# EAGLE design M843E (EAGLE 6.6.0)
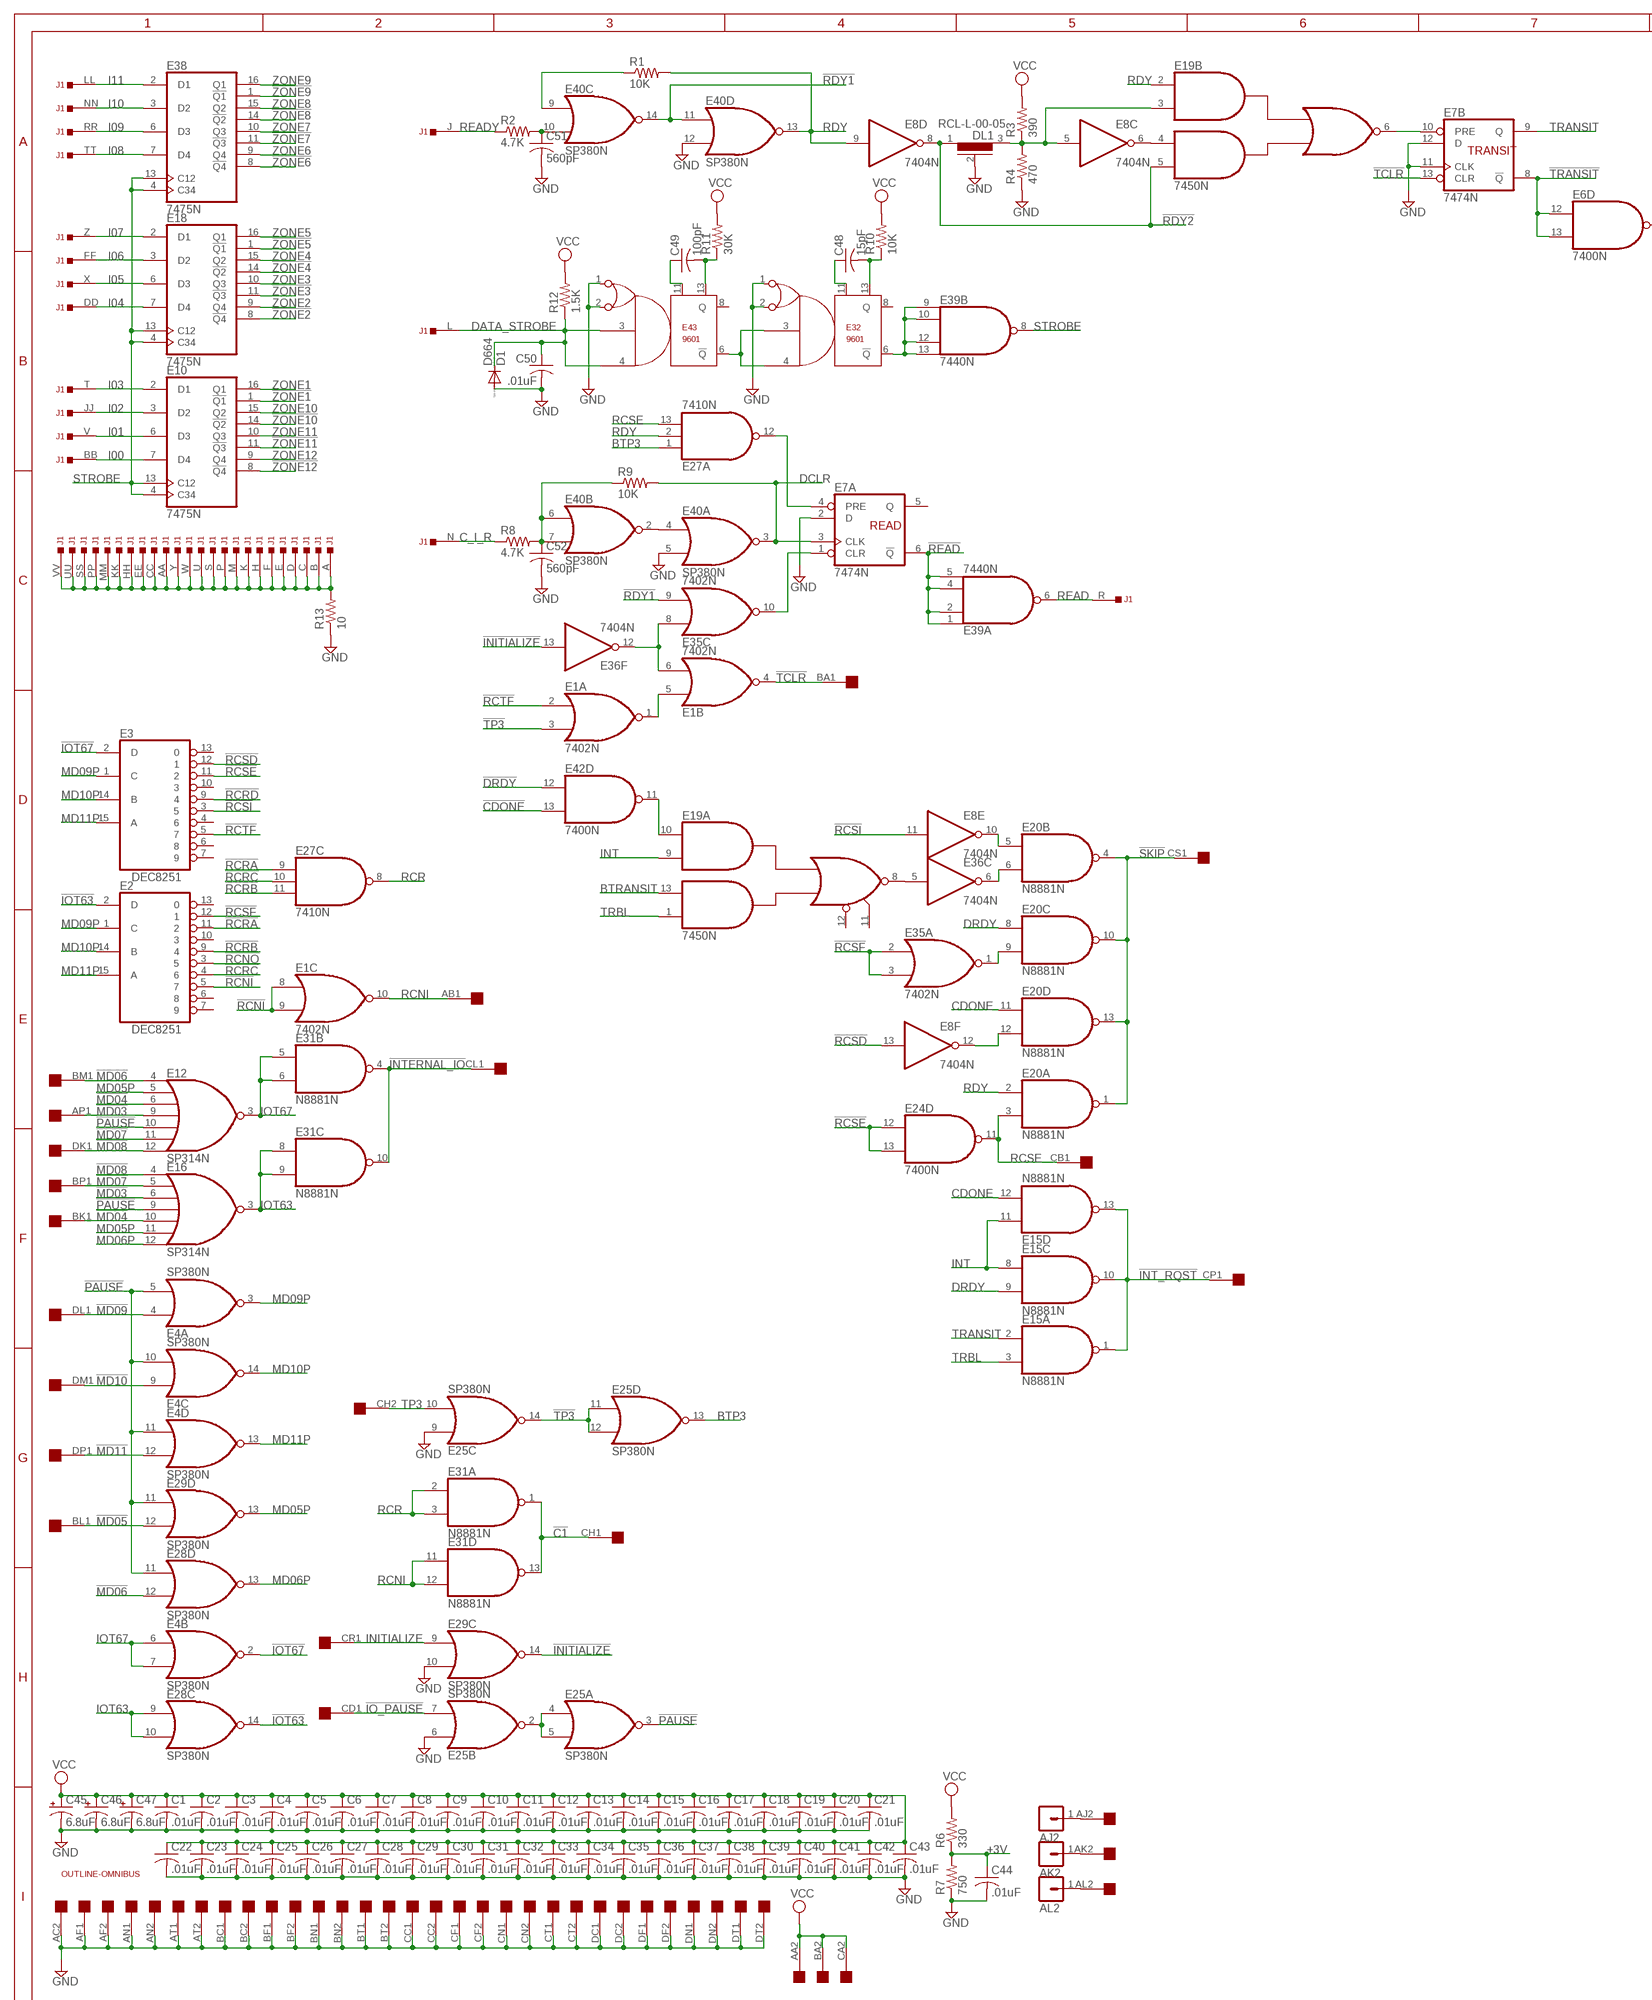
[diagram p0: schematic, sheet 1, part 1 of 2]
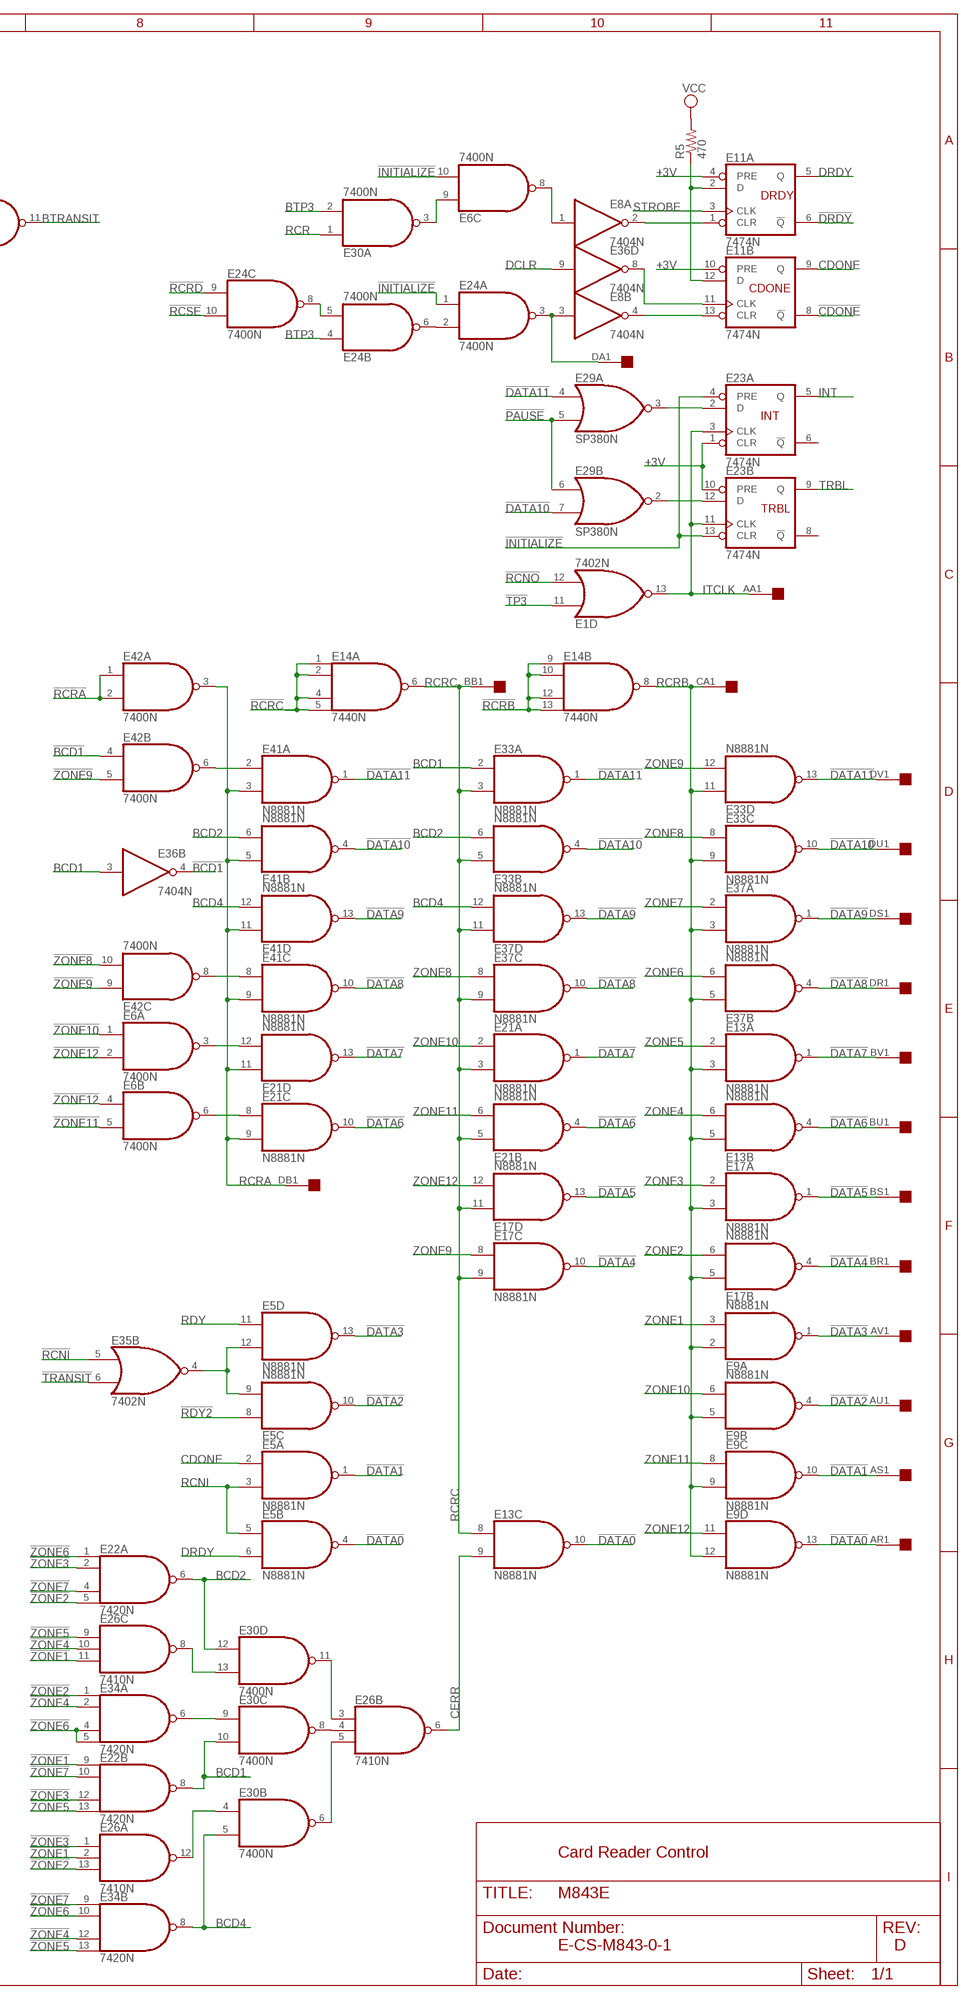
[diagram p1: schematic, sheet 1, part 2 of 2]

## Parts
AJ2  MA01-1  [MA01-1]
AK2  MA01-1  [MA01-1]
AL2  MA01-1  [MA01-1]
C1  .01uF  C-US075-032X103  [C075-032X103]
C2  .01uF  C-US  [C063-025X075]
C3  .01uF  C-US  [C063-025X075]
C4  .01uF  C-US  [C063-025X075]
C5  .01uF  C-US  [C063-025X075]
C6  .01uF  C-US075-032X103  [C075-032X103]
C7  .01uF  C-US  [C063-025X075]
C8  .01uF  C-US  [C063-025X075]
C9  .01uF  C-US  [C063-025X075]
C10  .01uF  C-US  [C063-025X075]
C11  .01uF  C-US  [C063-025X075]
C12  .01uF  C-US  [C063-025X075]
C13  .01uF  C-US  [C063-025X075]
C14  .01uF  C-US  [C063-025X075]
C15  .01uF  C-US  [C063-025X075]
C16  .01uF  C-US  [C063-025X075]
C17  .01uF  C-US  [C063-025X075]
C18  .01uF  C-US  [C063-025X075]
C19  .01uF  C-US  [C063-025X075]
C20  .01uF  C-US  [C063-025X075]
C21  .01uF  C-US  [C063-025X075]
C22  .01uF  C-US  [C063-025X075]
C23  .01uF  C-US  [C063-025X075]
C24  .01uF  C-US  [C063-025X075]
C25  .01uF  C-US  [C063-025X075]
C26  .01uF  C-US  [C063-025X075]
C27  .01uF  C-US  [C063-025X075]
C28  .01uF  C-US  [C063-025X075]
C29  .01uF  C-US  [C063-025X075]
C30  .01uF  C-US  [C063-025X075]
C31  .01uF  C-US  [C063-025X075]
C32  .01uF  C-US  [C063-025X075]
C33  .01uF  C-US  [C063-025X075]
C34  .01uF  C-US  [C063-025X075]
C35  .01uF  C-US  [C063-025X075]
C36  .01uF  C-US  [C063-025X075]
C37  .01uF  C-US  [C063-025X075]
C38  .01uF  C-US  [C063-025X075]
C39  .01uF  C-US  [C063-025X075]
C40  .01uF  C-US  [C063-025X075]
C41  .01uF  C-US  [C063-025X075]
C42  .01uF  C-US  [C063-025X075]
C43  .01uF  C-US  [C063-025X075]
C44  .01uF  C-US  [C063-025X075]
C45  6.8uF  CPOL-USE20-8AXIAL  [E12-8]
C46  6.8uF  CPOL-USE20-8AXIAL  [E12-8]
C47  6.8uF  CPOL-USE20-8AXIAL  [E12-8]
C48  15pF  C-US075-032X103  [C075-032X103]
C49  100pF  C-US075-032X103  [C075-032X103]
C50  .01uF  C-US  [C063-025X075]
C51  560pF  C-US075-032X103  [C075-032X103]
C52  560pF  C-US075-032X103  [C075-032X103]
D1  D664  DIODE-DO35-10  [DO35-10]
DL1  RCL-L-00-05  [RCL-L-00-05]
E1  7402N  [DIL14]
E2  DEC8251  [DIL16]
E3  DEC8251  [DIL16]
E4  SP380N  [DIL14]
E5  N8881N  [DIL14]
E6  7400N  [DIL14]
E7  7474N  74S74N  [DIL14]
E8  7404N  [DIL14]
E9  N8881N  [DIL14]
E10  7475N  [DIL16]
E11  7474N  74S74N  [DIL14]
E12  SP314N  [DIL14]
E13  N8881N  [DIL14]
E14  7440N  [DIL14]
E15  N8881N  [DIL14]
E16  SP314N  [DIL14]
E17  N8881N  [DIL14]
E18  7475N  [DIL16]
E19  7450N  [DIL14]
E20  N8881N  [DIL14]
E21  N8881N  [DIL14]
E22  7420N  [DIL14]
E23  7474N  74S74N  [DIL14]
E24  7400N  [DIL14]
E25  SP380N  [DIL14]
E26  7410N  [DIL14]
E27  7410N  [DIL14]
E28  SP380N  [DIL14]
E29  SP380N  [DIL14]
E30  7400N  [DIL14]
E31  N8881N  [DIL14]
E32  9601  [DIL14]
E33  N8881N  [DIL14]
E34  7420N  [DIL14]
E35  7402N  [DIL14]
E36  7404N  [DIL14]
E37  N8881N  [DIL14]
E38  7475N  [DIL16]
E39  7440N  [DIL14]
E40  SP380N  [DIL14]
E41  N8881N  [DIL14]
E42  7400N  [DIL14]
E43  9601  [DIL14]
EDGE  OMNIBUS  QUAD  [EDGE-CON8]
J1  DEC40PINSH  [DEC40PINH]
R1  10K  R-US_0207/10  [0207/10]
R2  4.7K  R-US_0207/10  [0207/10]
R3  390  R-US_0207/10  [0207/10]
R4  470  R-US_0207/10  [0207/10]
R5  470  R-US_0207/10  [0207/10]
R6  330  R-US_0207/10  [0207/10]
R7  750  R-US_0207/10  [0207/10]
R8  4.7K  R-US_0207/10  [0207/10]
R9  10K  R-US_0207/10  [0207/10]
R10  10K  R-US_0207/10  [0207/10]
R11  30K  R-US_0207/10  [0207/10]
R12  1.5K  R-US_0207/10  [0207/10]
R13  10  R-US_0207/10  [0207/10]
U$4  OUTLINE-OMNIBUS  [OMNIBUS]

## Nets
!BCD1: E36.4(B:O) E42.4(B:I0)
!C1: E31.1(A:O) E31.13(D:O) EDGE.CH1
!CDONE: E11.8(B:!Q) E42.13(D:I1)
!DATA0: E5.4(B:O) E9.13(D:O) E13.10(C:O) EDGE.AR1
!DATA1: E5.1(A:O) E9.10(C:O) EDGE.AS1
!DATA2: E5.10(C:O) E9.4(B:O) EDGE.AU1
!DATA3: E5.13(D:O) E9.1(A:O) EDGE.AV1
!DATA4: E17.4(B:O) E17.10(C:O) EDGE.BR1
!DATA5: E17.1(A:O) E17.13(D:O) EDGE.BS1
!DATA6: E13.4(B:O) E21.4(B:O) E21.10(C:O) EDGE.BU1
!DATA7: E13.1(A:O) E21.1(A:O) E21.13(D:O) EDGE.BV1
!DATA8: E37.4(B:O) E37.10(C:O) E41.10(C:O) EDGE.DR1
!DATA9: E37.1(A:O) E37.13(D:O) E41.13(D:O) EDGE.DS1
!DATA10: E29.7(B:I1) E33.4(B:O) E33.10(C:O) E41.4(B:O) EDGE.DU1
!DATA11: E29.4(A:I0) E33.1(A:O) E33.13(D:O) E41.1(A:O) EDGE.DV1
!DRDY: E11.6(A:!Q) E42.12(D:I0)
!INITIALIZE: E6.10(C:I1) E23.4(A:PRE) E23.13(B:CLR) E24.1(A:I0) E29.14(C:O) E36.13(F:I)
!INT_RQST: E15.1(A:O) E15.10(C:O) E15.13(D:O) EDGE.CP1
!INTERNAL_IO: E31.4(B:O) E31.10(C:O) EDGE.CL1
!IO_PAUSE: E25.7(B:I1) EDGE.CD1
!IOT63: E2.2(D) E28.14(C:O)
!IOT67: E3.2(D) E4.2(B:O)
!MD03: E12.9(I3) E16.6(I2) EDGE.AP1
!MD04: E12.6(I2) E16.10(I4) EDGE.BK1
!MD05: E29.12(D:I1) EDGE.BL1
!MD06: E12.4(I0) E28.12(D:I1) EDGE.BM1
!MD07: E12.11(I5) E16.5(I1) EDGE.BP1
!MD08: E12.12(I6) E16.4(I0) EDGE.DK1
!MD09: E4.4(A:I0) EDGE.DL1
!MD10: E4.9(C:I0) EDGE.DM1
!MD11: E4.12(D:I1) EDGE.DP1
!PAUSE: E4.5(A:I1) E4.10(C:I1) E4.11(D:I0) E12.10(I4) E16.9(I3) E25.3(A:O) E28.11(D:I0) E29.5(A:I1) E29.6(B:I0) E29.11(D:I0)
!RCNI: E1.8(C:I0) E1.9(C:I1) E2.5 E35.5(B:I0)
!RCNO: E1.12(D:I1) E2.3
!RCRA: E2.11 E27.9(C:I0) E42.1(A:I0) E42.2(A:I1)
!RCRB: E2.9 E14.9(B:I0) E14.10(B:I1) E14.12(B:I2) E14.13(B:I3) E27.11(C:I2)
!RCRC: E2.4 E14.1(A:I0) E14.2(A:I1) E14.4(A:I2) E14.5(A:I3) E27.10(C:I1)
!RCRD: E3.9 E24.9(C:I0)
!RCSD: E3.12 E8.13(F:I)
!RCSE: E3.11 E24.10(C:I1) E24.12(D:I0) E24.13(D:I1)
!RCSF: E2.12 E35.2(A:I0) E35.3(A:I1)
!RCSI: E3.3 E8.11(E:I)
!RCTF: E1.2(A:I0) E3.5
!RDY1: E35.9(C:I1) E40.11(D:I0) E40.14(C:O)
!RDY2: DL1.1 E5.8(C:I0) E8.8(D:O) E19.5(B:I4)
!READ: E7.6(A:!Q) E39.1(A:I0) E39.2(A:I1) E39.4(A:I2) E39.5(A:I3)
!SKIP: E20.1(A:O) E20.4(B:O) E20.10(C:O) E20.13(D:O) EDGE.CS1
!TCLR: E1.4(B:O) E7.13(B:CLR) EDGE.BA1
!TP3: E1.3(A:I1) E1.11(D:I0) E25.11(D:I0) E25.12(D:I1) E25.14(C:O)
!TRANSIT: E6.12(D:I0) E6.13(D:I1) E7.8(B:!Q) E35.6(B:I1)
!ZONE1: E10.1(!Q1) E22.9(B:I0) E26.2(A:I1) E26.11(C:I2)
!ZONE2: E18.8(!Q4) E22.5(A:I3) E26.13(A:I2) E34.1(A:I0)
!ZONE3: E18.11(!Q3) E22.2(A:I1) E22.12(B:I2) E26.1(A:I0)
!ZONE4: E18.14(!Q2) E26.10(C:I1) E34.2(A:I1) E34.12(B:I2)
!ZONE5: E18.1(!Q1) E22.13(B:I3) E26.9(C:I0) E34.13(B:I3)
!ZONE6: E22.1(A:I0) E34.4(A:I2) E34.5(A:I3) E34.10(B:I1) E38.8(!Q4)
!ZONE7: E22.4(A:I2) E22.10(B:I1) E34.9(B:I0) E38.11(!Q3)
!ZONE8: E38.14(!Q2) E42.10(C:I1)
!ZONE9: E38.1(!Q1) E42.5(B:I1) E42.9(C:I0)
!ZONE10: E6.1(A:I0) E10.14(!Q2)
!ZONE11: E6.5(B:I1) E10.11(!Q3)
!ZONE12: E6.2(A:I1) E6.4(B:I0) E10.8(!Q4)
+3V: C44.1 E11.4(A:PRE) E11.10(B:PRE) E23.1(A:CLR) E23.10(B:PRE) R6.1 R7.2
AJ2: AJ2.1 EDGE.AJ2
AK2: AK2.1 EDGE.AK2
AL2: AL2.1 EDGE.AL2
BCD1: E22.8(B:O) E30.10(C:I1) E33.2(A:I0) E36.3(B:I)
BCD2: E22.6(A:O) E30.12(D:I0) E33.6(B:I1) E41.6(B:I1)
BCD4: E30.5(B:I1) E34.8(B:O) E37.12(D:I1) E41.12(D:I1)
BTP3: E24.4(B:I0) E25.13(D:O) E27.1(A:I0) E30.2(A:I1)
BTRANSIT: E6.11(D:O) E19.13(A:I3)
C_I_R: J1.N R8.1
CDONE: E5.2(A:I0) E11.9(B:Q) E15.12(D:I1) E20.11(D:I0)
CERR: E13.9(C:I1) E26.6(B:O)
DATA_STROBE: C50.1 D1.C E43.3 E43.4 J1.L R12.1
DCLR: E7.3(A:CLK) E36.9(D:I) E40.3(A:O) R9.2
DRDY: E5.6(B:I1) E11.5(A:Q) E15.9(C:I1) E20.8(C:I0)
GND [Supply]: C1.2 C2.2 C3.2 C4.2 C5.2 C6.2 C7.2 C8.2 C9.2 C10.2 C11.2 C12.2 C13.2 C14.2 C15.2 C16.2 C17.2 C18.2 C19.2 C20.2 C21.2 C22.2 C23.2 C24.2 C25.2 C26.2 C27.2 C28.2 C29.2 C30.2 C31.2 C32.2 C33.2 C34.2 C35.2 C36.2 C37.2 C38.2 C39.2 C40.2 C41.2 C42.2 C43.2 C44.2 C45.- C46.- C47.- C50.2 C51.2 C52.2 D1.A DL1.2 E7.2(A:D) E7.11(B:CLK) E7.12(B:D) E25.6(B:I0) E25.9(C:I0) E29.10(C:I1) E32.1 E32.2 E40.5(A:I1) E40.12(D:I1) E43.1 E43.2 EDGE.AC2 EDGE.AF1 EDGE.AF2 EDGE.AN1 EDGE.AN2 EDGE.AT1 EDGE.AT2 EDGE.BC1 EDGE.BC2 EDGE.BF1 EDGE.BF2 EDGE.BN1 EDGE.BN2 EDGE.BT1 EDGE.BT2 EDGE.CC1 EDGE.CC2 EDGE.CF1 EDGE.CF2 EDGE.CN1 EDGE.CN2 EDGE.CT1 EDGE.CT2 EDGE.DC1 EDGE.DC2 EDGE.DF1 EDGE.DF2 EDGE.DN1 EDGE.DN2 EDGE.DT1 EDGE.DT2 R4.1 R7.1 R13.1
I00: E10.7(D4) J1.BB
I01: E10.6(D3) J1.V
I02: E10.3(D2) J1.JJ
I03: E10.2(D1) J1.T
I04: E18.7(D4) J1.DD
I05: E18.6(D3) J1.X
I06: E18.3(D2) J1.FF
I07: E18.2(D1) J1.Z
I08: E38.7(D4) J1.TT
I09: E38.6(D3) J1.RR
I10: E38.3(D2) J1.NN
I11: E38.2(D1) J1.LL
INITIALIZE: E29.9(C:I0) EDGE.CR1
INT: E15.8(C:I0) E15.11(D:I0) E19.9(A:I2) E23.5(A:Q)
IOT63: E16.3(O) E28.9(C:I0) E28.10(C:I1) E31.8(C:I0) E31.9(C:I1)
IOT67: E4.6(B:I0) E4.7(B:I1) E12.3(O) E31.5(B:I0) E31.6(B:I1)
ITCLK: E1.13(D:O) E23.3(A:CLK) E23.11(B:CLK) EDGE.AA1
MD05P: E12.5(I1) E16.11(I5) E29.13(D:O)
MD06P: E16.12(I6) E28.13(D:O)
MD09P: E2.1(C) E3.1(C) E4.3(A:O)
MD10P: E2.14(B) E3.14(B) E4.14(C:O)
MD11P: E2.15(A) E3.15(A) E4.13(D:O)
N$1: E26.3(B:I0) E30.11(D:O)
N$2: E25.2(B:O) E25.4(A:I0) E25.5(A:I1)
N$3: E11.11(B:CLK) E36.8(D:O)
N$4: E6.8(C:O) E8.1(A:I)
N$5: E5.9(C:I1) E5.12(D:I1) E35.4(B:O)
N$6: E32.6(!Q) E39.9(B:I0) E39.10(B:I1) E39.12(B:I2) E39.13(B:I3)
N$7: E32.3 E32.4 E43.6(!Q)
N$8: E26.4(B:I1) E30.8(C:O)
N$9: C49.2 E43.13 R11.1
N$10: E30.9(C:I0) E34.6(A:O)
N$11: C49.1 E43.11
N$12: C48.2 E32.13 R10.1
N$13: C52.1 E40.6(B:I0) E40.7(B:I1) R8.2 R9.1
N$14: C48.1 E32.11
N$15: E19.8(A:O) E36.5(C:I)
N$16: E40.2(B:O) E40.4(A:I0)
N$18: C51.1 E40.10(C:I1) R2.2
N$19: E26.5(B:I2) E30.6(B:O)
N$20: E6.3(A:O) E21.12(D:I1)
N$21: E41.2(A:I0) E42.6(B:O)
N$22: DL1.3 E8.5(C:I) E19.3(B:I2) R3.1 R4.2
N$23: E6.6(B:O) E21.8(C:I0)
N$24: E41.8(C:I0) E42.8(C:O)
N$25: E40.9(C:I0) R1.1
N$26: E8.6(C:O) E19.4(B:I3)
N$27: E8.4(B:O) E11.13(B:CLR)
N$28: E8.3(B:I) E24.3(A:O) EDGE.DA1
N$29: E6.9(C:I0) E30.3(A:O)
N$30: E8.2(A:O) E11.1(A:CLR)
N$31: E7.10(B:PRE) E19.6(B:O)
N$32: E26.12(A:O) E30.4(B:I0)
N$33: E26.8(C:O) E30.13(D:I1)
N$34: E11.2(A:D) E11.12(B:D) R5.1
N$35: E7.1(A:CLR) E35.10(C:O)
N$36 [Supply]: J1.A J1.AA J1.B J1.C J1.CC J1.D J1.E J1.EE J1.F J1.H J1.HH J1.K J1.KK J1.M J1.MM J1.P J1.PP J1.S J1.SS J1.U J1.UU J1.VV J1.W J1.Y R13.2
N$37: E23.2(A:D) E29.3(A:O)
N$38: E7.4(A:PRE) E27.12(A:O)
N$39: E20.6(B:I1) E36.6(C:O)
N$40: E19.10(A:I1) E42.11(D:O)
N$41: E24.2(A:I1) E24.6(B:O)
N$42: E20.9(C:I1) E35.1(A:O)
N$43: E8.12(F:O) E20.12(D:I1)
N$44: E1.6(B:I1) E35.8(C:I0) E36.12(F:O)
N$45: E23.12(B:D) E29.2(B:O)
N$46: E1.1(A:O) E1.5(B:I0)
N$47: E24.5(B:I1) E24.8(C:O)
RCNI: E1.10(C:O) E5.3(A:I1) E5.5(B:I0) E31.11(D:I0) E31.12(D:I1) EDGE.AB1
RCR: E27.8(C:O) E30.1(A:I0) E31.2(A:I0) E31.3(A:I1)
RCRA: E21.9(C:I1) E21.11(D:I0) E41.3(A:I1) E41.5(B:I0) E41.9(C:I1) E41.11(D:I0) E42.3(A:O) EDGE.DB1
RCRB: E9.2(A:I0) E9.5(B:I0) E9.9(C:I1) E9.12(D:I1) E13.3(A:I1) E13.5(B:I0) E14.8(B:O) E17.3(A:I1) E17.5(B:I0) E33.9(C:I1) E33.11(D:I0) E37.3(A:I1) E37.5(B:I0) EDGE.CA1
RCRC: E13.8(C:I0) E14.6(A:O) E17.9(C:I1) E17.11(D:I0) E21.3(A:I1) E21.5(B:I0) E33.3(A:I1) E33.5(B:I0) E37.9(C:I1) E37.11(D:I0) EDGE.BB1
RCSE: E20.3(A:I1) E24.11(D:O) E27.13(A:I2) EDGE.CB1
RCSI: E8.10(E:O) E20.5(B:I0)
RDY: E5.11(D:I0) E8.9(D:I) E19.2(B:I1) E20.2(A:I0) E27.2(A:I1) E40.13(D:O) R1.2
READ: E39.6(A:O) J1.R
READY: J1.J R2.1
STROBE: E10.4(C34) E10.13(C12) E11.3(A:CLK) E18.4(C34) E18.13(C12) E38.4(C34) E38.13(C12) E39.8(B:O)
TP3: E25.10(C:I1) EDGE.CH2
TRANSIT: E7.9(B:Q) E15.2(A:I0)
TRBL: E15.3(A:I1) E19.1(A:I4) E23.9(B:Q)
VCC [Supply]: C1.1 C2.1 C3.1 C4.1 C5.1 C6.1 C7.1 C8.1 C9.1 C10.1 C11.1 C12.1 C13.1 C14.1 C15.1 C16.1 C17.1 C18.1 C19.1 C20.1 C21.1 C22.1 C23.1 C24.1 C25.1 C26.1 C27.1 C28.1 C29.1 C30.1 C31.1 C32.1 C33.1 C34.1 C35.1 C36.1 C37.1 C38.1 C39.1 C40.1 C41.1 C42.1 C43.1 C45.+ C46.+ C47.+ EDGE.AA2 EDGE.BA2 EDGE.CA2 R3.2 R5.2 R6.2 R10.2 R11.2 R12.2
ZONE1: E9.3(A:I1) E10.16(Q1)
ZONE2: E17.6(B:I1) E18.9(Q4)
ZONE3: E17.2(A:I0) E18.10(Q3)
ZONE4: E13.6(B:I1) E18.15(Q2)
ZONE5: E13.2(A:I0) E18.16(Q1)
ZONE6: E37.6(B:I1) E38.9(Q4)
ZONE7: E37.2(A:I0) E38.10(Q3)
ZONE8: E33.8(C:I0) E37.8(C:I0) E38.15(Q2)
ZONE9: E17.8(C:I0) E33.12(D:I1) E38.16(Q1)
ZONE10: E9.6(B:I1) E10.15(Q2) E21.2(A:I0)
ZONE11: E9.8(C:I0) E10.10(Q3) E21.6(B:I1)
ZONE12: E9.11(D:I0) E10.9(Q4) E17.12(D:I1)
Unconnected: E2.6 E2.7 E2.10 E2.13 E3.4 E3.6 E3.7 E3.10 E3.13 E7.5(A:Q) E12.2(NC) E12.7(NC) E12.13(NC) E12.14(NC) E13.11(D:I0) E13.12(D:I1) E13.13(D:O) E14.3(3:NC) E14.11(11:NC) E15.4(B:O) E15.5(B:I0) E15.6(B:I1) E16.2(NC) E16.7(NC) E16.13(NC) E16.14(NC) E19.11(A:I6) E19.12(A:I5) E22.3(3:NC) E22.11(11:NC) E23.6(A:!Q) E23.8(B:!Q) E27.3(B:I0) E27.4(B:I1) E27.5(B:I2) E27.6(B:O) E28.2(B:O) E28.3(A:O) E28.4(A:I0) E28.5(A:I1) E28.6(B:I0) E28.7(B:I1) E32.8(Q) E34.3(3:NC) E34.11(11:NC) E35.11(D:I0) E35.12(D:I1) E35.13(D:O) E36.1(A:I) E36.2(A:O) E36.10(E:O) E36.11(E:I) E39.3(3:NC) E39.11(11:NC) E43.8(Q) EDGE.AB2 EDGE.AC1 EDGE.AD1 EDGE.AD2 EDGE.AE1 EDGE.AE2 EDGE.AH1 EDGE.AH2 EDGE.AJ1 EDGE.AK1 EDGE.AL1 EDGE.AM1 EDGE.AM2 EDGE.AP2 EDGE.AR2 EDGE.AS2 EDGE.AU2 EDGE.AV2 EDGE.BB2 EDGE.BD1 EDGE.BD2 EDGE.BE1 EDGE.BE2 EDGE.BH1 EDGE.BH2 EDGE.BJ1 EDGE.BJ2 EDGE.BK2 EDGE.BL2 EDGE.BM2 EDGE.BP2 EDGE.BR2 EDGE.BS2 EDGE.BU2 EDGE.BV2 EDGE.CB2 EDGE.CD2 EDGE.CE1 EDGE.CE2 EDGE.CJ1 EDGE.CJ2 EDGE.CK1 EDGE.CK2 EDGE.CL2 EDGE.CM1 EDGE.CM2 EDGE.CP2 EDGE.CR2 EDGE.CS2 EDGE.CU1 EDGE.CU2 EDGE.CV1 EDGE.CV2 EDGE.DA2 EDGE.DB2 EDGE.DD1 EDGE.DD2 EDGE.DE1 EDGE.DE2 EDGE.DH1 EDGE.DH2 EDGE.DJ1 EDGE.DJ2 EDGE.DK2 EDGE.DL2 EDGE.DM2 EDGE.DP2 EDGE.DR2 EDGE.DS2 EDGE.DU2 EDGE.DV2

## Notes on the sheet
- TRANSIT
- DRDY
- CDONE
- INT
- TRBL
- READ
- Card Reader Control
- E-CS-M843-0-1 | D

## Power pins joined to a net without a drawn wire
GND: E1.7(P:GND) E2.8(GND) E3.8(GND) E4.1(P:GND) E5.7(P:GND) E6.7(P:GND) E7.7(P:GND) E8.7(P:GND) E9.7(P:GND) E10.12(GND) E11.7(P:GND) E12.1(GND) E13.7(P:GND) E14.7(P:GND) E15.7(P:GND) E16.1(GND) E17.7(P:GND) E18.12(GND) E19.7(P:GND) E20.7(P:GND) E21.7(P:GND) E22.7(P:GND) E23.7(P:GND) E24.7(P:GND) E25.1(P:GND) E26.7(P:GND) E27.7(P:GND) E28.1(P:GND) E29.1(P:GND) E30.7(P:GND) E31.7(P:GND) E32.7(GND) E33.7(P:GND) E34.7(P:GND) E35.7(P:GND) E36.7(P:GND) E37.7(P:GND) E38.12(GND) E39.7(P:GND) E40.1(P:GND) E41.7(P:GND) E42.7(P:GND) E43.7(GND)
VCC: E1.14(P:VCC) E2.16(VCC) E3.16(VCC) E4.8(P:VCC) E5.14(P:VCC) E6.14(P:VCC) E7.14(P:VCC) E8.14(P:VCC) E9.14(P:VCC) E10.5(VCC) E11.14(P:VCC) E12.8(VCC) E13.14(P:VCC) E14.14(P:VCC) E15.14(P:VCC) E16.8(VCC) E17.14(P:VCC) E18.5(VCC) E19.14(P:VCC) E20.14(P:VCC) E21.14(P:VCC) E22.14(P:VCC) E23.14(P:VCC) E24.14(P:VCC) E25.8(P:VCC) E26.14(P:VCC) E27.14(P:VCC) E28.8(P:VCC) E29.8(P:VCC) E30.14(P:VCC) E31.14(P:VCC) E32.14(VCC) E33.14(P:VCC) E34.14(P:VCC) E35.14(P:VCC) E36.14(P:VCC) E37.14(P:VCC) E38.5(VCC) E39.14(P:VCC) E40.8(P:VCC) E41.14(P:VCC) E42.14(P:VCC) E43.14(VCC)

## Library data of the parts
AJ2 AK2 AL2 = dec-con:MA01-1: Pin Header (.125" spacing)
C1 C6 C48 C49 C51 C52 = rcl:C-US: CAPACITOR, American symbol
C2-C5 C7-C44 C50 = dec-con:C-US: Capacitors with funky DEC lead spacing.
C45-C47 = dec-con:CPOL-USE20-8AXIAL: A 0.8 inch electrolytic.
D1 = diode:DIODE-: DIODE
DL1 = dec-con:RCL-L-00-05: RCL-L Delay Line
E1 E35 = 74xx-us:74*02: Quad 2-input NOR gate
E2 E3 = dec-con:DEC8251: BCD Decoder
E4 E25 E28 E29 E40 = dec-con:SP380: Quad NOR gate (use 8640)
E5 E9 E13 E15 E17 E20 E21 E31 E33 E37 E41 = dec-con:N8881: Quad 2-input NAND gate, open collector
E6 E24 E30 E42 = 74xx-us:74*00: Quad 2-input NAND gate
E7 E11 E23 = 74xx-us:74*74: Dual D type positive edge triggered FLIP FLOP, preset and clear
E8 E36 = 74xx-us:74*04: Hex INVERTER
E10 E18 E38 = 74xx-us:74*75: 4-bit bistable LATCH
E12 E16 = dec-con:SP314: 7-Input NOR gate
E14 E39 = dec-con:74*40: Dual 4-input NAND gate
E19 = dec-con:74*50: 4-2-3-2 input AND OR INVERTER gates
E22 E34 = dec-con:74*20: Dual 4-input NAND gate
E26 E27 = 74xx-us:74*10: Triple 3-input NAND gate
E32 E43 = dec-con:9601: DEC9601 monstable
EDGE = dec-con:QUAD: Quad-Height DEC board
J1 = dec-con:DEC40PINS: 40 pin ribbon connector for BC08, BC11 cables.
R1-R13 = rcl:R-US_: RESISTOR, American symbol
U$4 = dec-con:OUTLINE-*: Board outlines for DEC boards.

## Net classes
1 Supply: width 0.813 mm

## Board
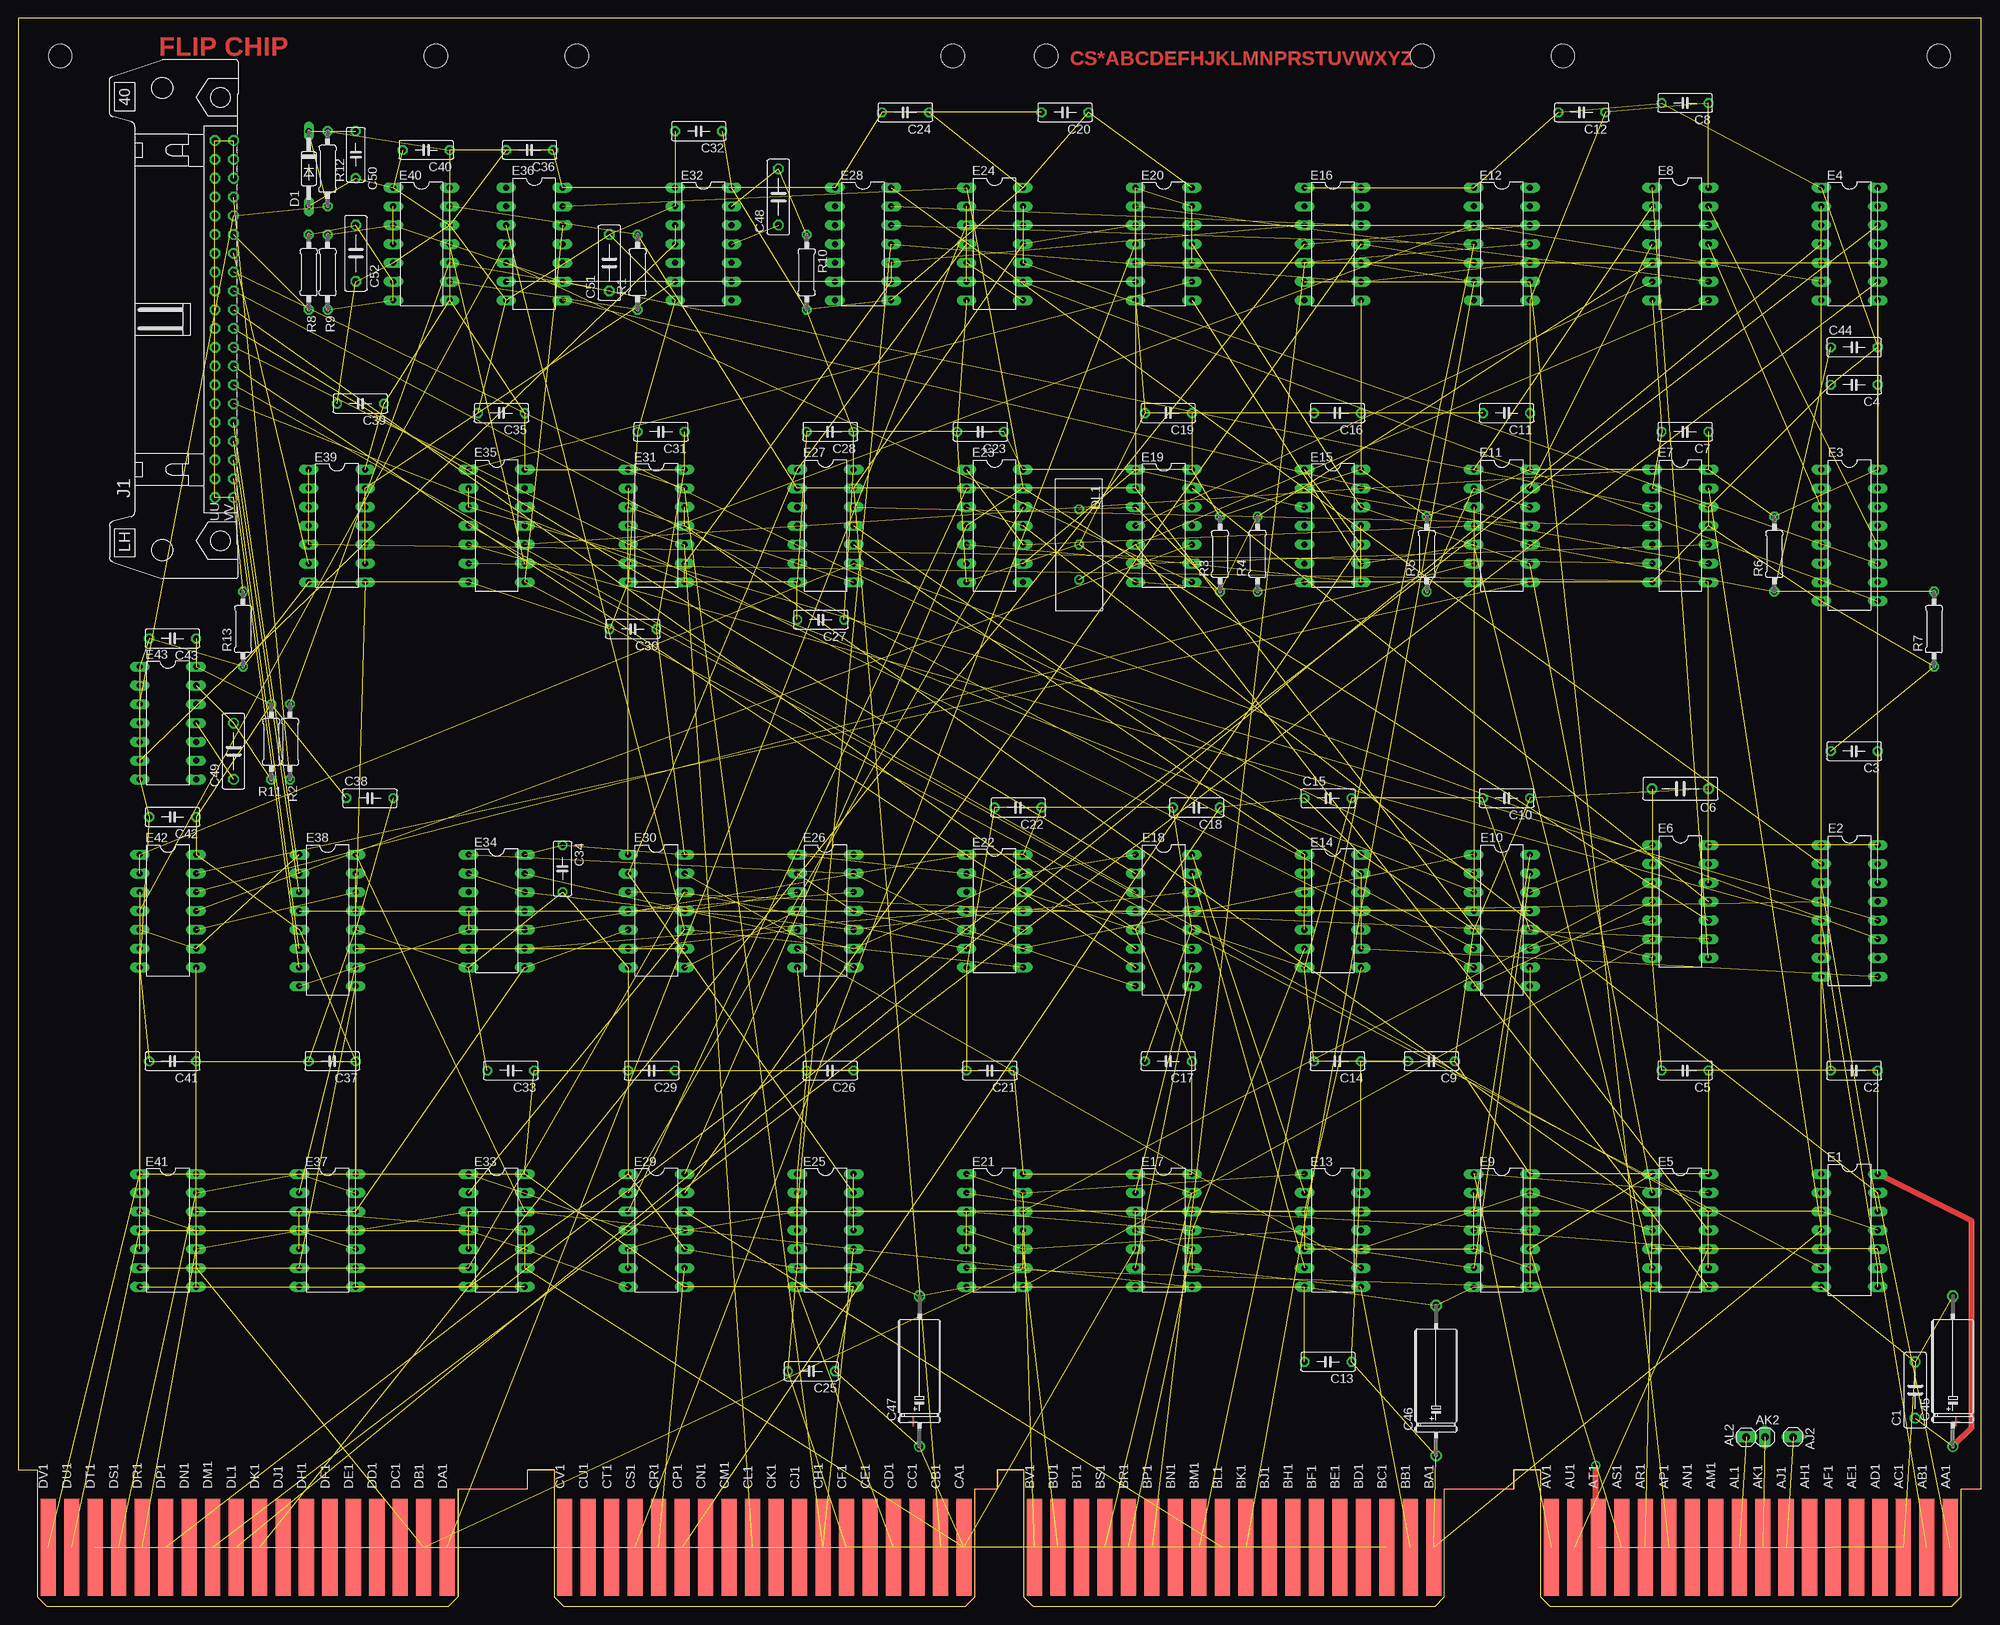
[diagram p2: board, top side]
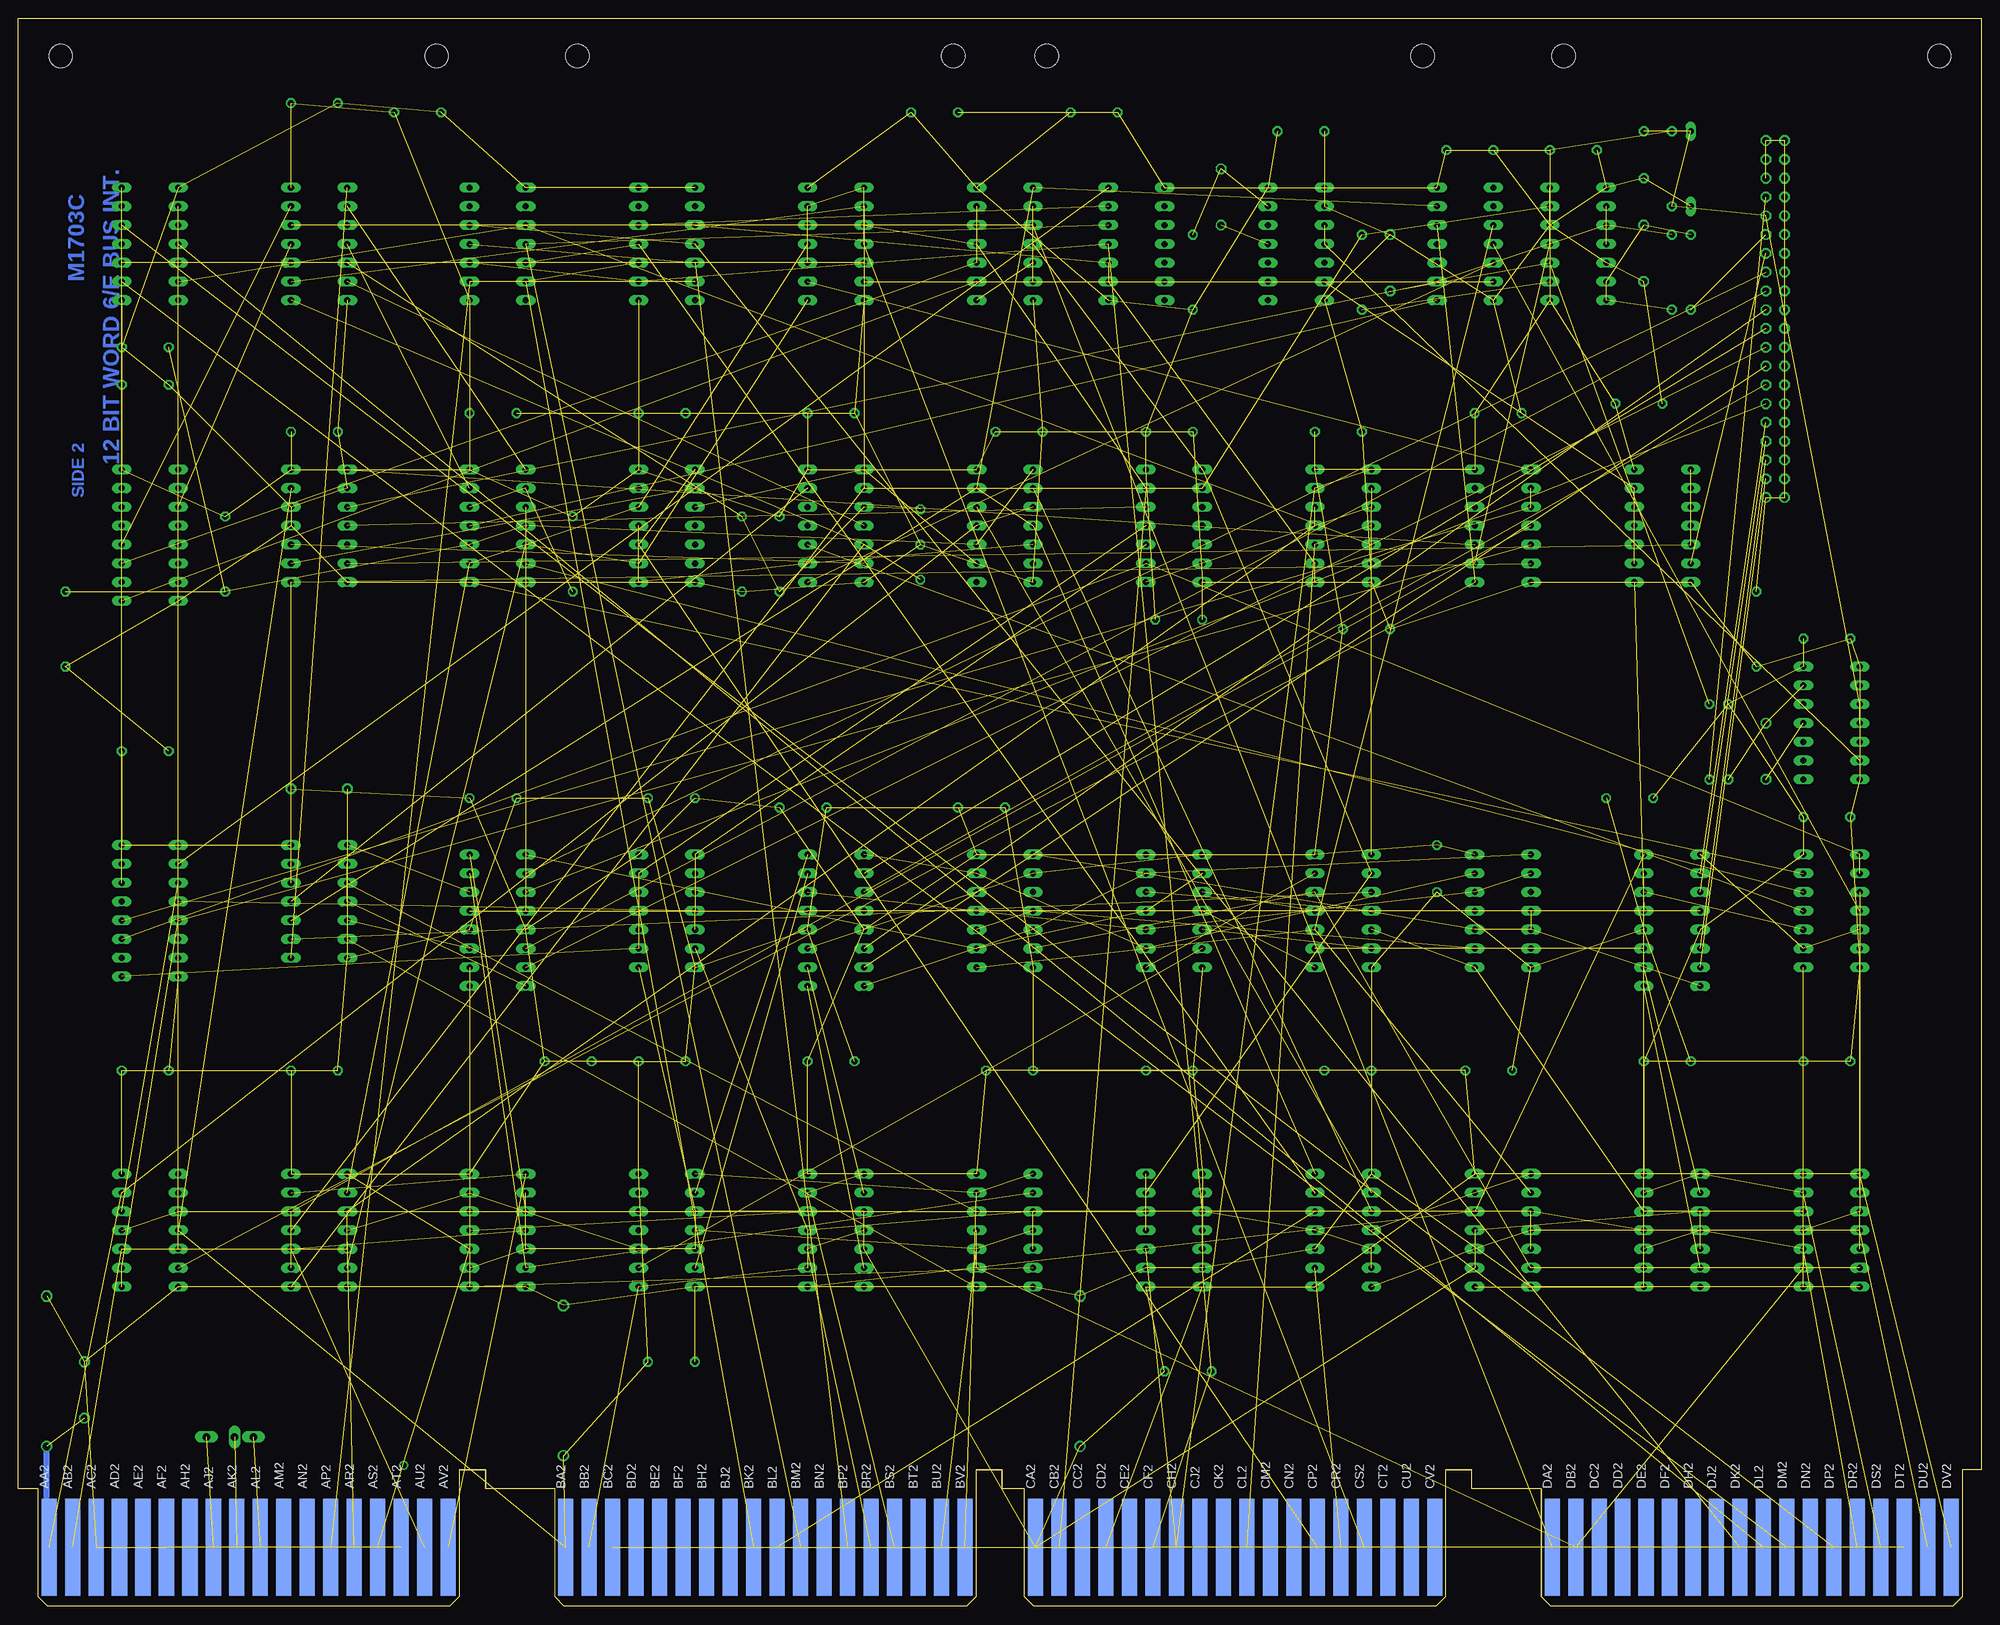
[diagram p3: board, bottom side, seen from below]

Size 265.3 x 214.63 mm. Coordinates in mm from the lower left corner, seen from the top.
Copper layers (1+16): Top 0.035mm / dielectric 1.5mm / Bottom 0.035mm
Design rules "16mils": minimum track width 16mil, minimum drill 32mil, track to track 15mil, track to pad 10mil, pad to pad 10mil, via to via 10mil, smd to smd 10mil, copper to edge 13mil, drill to drill 10mil, minimum pad ring 10mil, minimum via ring 8mil, stop-mask expansion 0mil, vias tented up to drill 0mil, thermal gap 10mil

### Footprints (pad centres in the part's own frame; a part is rotated, then mirrored left to right if it is on the bottom)
MA01-1 = drill 1.016 long: 1 0,0
C075-032X103 = drill 0.914 octagon: 1 -3.81,0; 2 3.81,0
C063-025X075 = drill 0.813 octagon: 1 -2.54,0; 2 3.81,0
E12-8 = drill 1.016: + -10.16,0 | drill 1.016 octagon: - 10.16,0
DO35-10 = drill 0.813 long: A 5.08,0; C -5.08,0
RCL-L-00-05 = drill 0.813 octagon: 1 4.763,0; 2 0,0; 3 -4.763,0
DIL14 = drill 0.813 long: 1 -7.62,-3.81; 2 -5.08,-3.81; 3 -2.54,-3.81; 4 0,-3.81; 5 2.54,-3.81; 6 5.08,-3.81; 7 7.62,-3.81; 8 7.62,3.81; 9 5.08,3.81; 10 2.54,3.81; 11 0,3.81; 12 -2.54,3.81; 13 -5.08,3.81; 14 -7.62,3.81
DIL16 = drill 0.813 long: 1 -8.89,-3.81; 2 -6.35,-3.81; 3 -3.81,-3.81; 4 -1.27,-3.81; 5 1.27,-3.81; 6 3.81,-3.81; 7 6.35,-3.81; 8 8.89,-3.81; 9 8.89,3.81; 10 6.35,3.81; 11 3.81,3.81; 12 1.27,3.81; 13 -1.27,3.81; 14 -3.81,3.81; 15 -6.35,3.81; 16 -8.89,3.81
EDGE-CON8 = smd 2.032 x 13.106: AA1 261.303,7.938; AB1 258.127,7.938; AC1 254.952,7.938; AD1 251.778,7.938; AE1 248.602,7.938; AF1 245.428,7.938; AH1 242.252,7.938; AJ1 239.077,7.938; AK1 235.903,7.938; AL1 232.727,7.938; AM1 229.553,7.938; AN1 226.377,7.938; AP1 223.202,7.938; AR1 220.028,7.938; AS1 216.852,7.938; AT1 213.678,7.938; AU1 210.502,7.938; AV1 207.327,7.938; BA1 191.452,7.938; BB1 188.278,7.938; BC1 185.102,7.938; BD1 181.928,7.938; BE1 178.752,7.938; BF1 175.577,7.938; BH1 172.403,7.938; BJ1 169.227,7.938; BK1 166.053,7.938; BL1 162.877,7.938; BM1 159.702,7.938; BN1 156.528,7.938; BP1 153.352,7.938; BR1 150.178,7.938; BS1 147.002,7.938; BT1 143.827,7.938; BU1 140.653,7.938; BV1 137.477,7.938; CA1 127.953,7.938; CB1 124.778,7.938; CC1 121.603,7.938; CD1 118.427,7.938; CE1 115.252,7.938; CF1 112.078,7.938; CH1 108.903,7.938; CJ1 105.728,7.938; CK1 102.552,7.938; CL1 99.377,7.938; CM1 96.203,7.938; CN1 93.028,7.938; CP1 89.853,7.938; CR1 86.677,7.938; CS1 83.502,7.938; CT1 80.328,7.938; CU1 77.153,7.938; CV1 73.978,7.938; DA1 58.102,7.938; DB1 54.928,7.938; DC1 51.752,7.938; DD1 48.578,7.938; DE1 45.403,7.938; DF1 42.227,7.938; DH1 39.053,7.938; DJ1 35.877,7.938; DK1 32.703,7.938; DL1 29.527,7.938; DM1 26.352,7.938; DN1 23.177,7.938; DP1 20.003,7.938; DR1 16.828,7.938; DS1 13.652,7.938; DT1 10.477,7.938; DU1 7.303,7.938; DV1 4.128,7.938 | smd 2.032 x 13.106 bottom: AA2 261.303,7.938; AB2 258.127,7.938; AC2 254.952,7.938; AD2 251.778,7.938; AE2 248.602,7.938; AF2 245.428,7.938; AH2 242.252,7.938; AJ2 239.077,7.938; AK2 235.903,7.938; AL2 232.727,7.938; AM2 229.553,7.938; AN2 226.377,7.938; AP2 223.202,7.938; AR2 220.028,7.938; AS2 216.852,7.938; AT2 213.678,7.938; AU2 210.502,7.938; AV2 207.327,7.938; BA2 191.452,7.938; BB2 188.278,7.938; BC2 185.102,7.938; BD2 181.928,7.938; BE2 178.752,7.938; BF2 175.577,7.938; BH2 172.403,7.938; BJ2 169.227,7.938; BK2 166.053,7.938; BL2 162.877,7.938; BM2 159.702,7.938; BN2 156.528,7.938; BP2 153.352,7.938; BR2 150.178,7.938; BS2 147.002,7.938; BT2 143.827,7.938; BU2 140.653,7.938; BV2 137.477,7.938; CA2 127.953,7.938; CB2 124.778,7.938; CC2 121.603,7.938; CD2 118.427,7.938; CE2 115.252,7.938; CF2 112.078,7.938; CH2 108.903,7.938; CJ2 105.728,7.938; CK2 102.552,7.938; CL2 99.377,7.938; CM2 96.203,7.938; CN2 93.028,7.938; CP2 89.853,7.938; CR2 86.677,7.938; CS2 83.502,7.938; CT2 80.328,7.938; CU2 77.153,7.938; CV2 73.978,7.938; DA2 58.102,7.938; DB2 54.928,7.938; DC2 51.752,7.938; DD2 48.578,7.938; DE2 45.403,7.938; DF2 42.227,7.938; DH2 39.053,7.938; DJ2 35.877,7.938; DK2 32.703,7.938; DL2 29.527,7.938; DM2 26.352,7.938; DN2 23.177,7.938; DP2 20.003,7.938; DR2 16.828,7.938; DS2 13.652,7.938; DT2 10.477,7.938; DU2 7.303,7.938; DV2 4.128,7.938
DEC40PINH = drill 0.914 octagon: A 24.13,1.27; AA -3.81,1.27; B 24.13,-1.27; BB -3.81,-1.27; C 21.59,1.27; CC -6.35,1.27; D 21.59,-1.27; DD -6.35,-1.27; E 19.05,1.27; EE -8.89,1.27; F 19.05,-1.27; FF -8.89,-1.27; H 16.51,1.27; HH -11.43,1.27; J 16.51,-1.27; JJ -11.43,-1.27; K 13.97,1.27; KK -13.97,1.27; L 13.97,-1.27; LL -13.97,-1.27; M 11.43,1.27; MM -16.51,1.27; N 11.43,-1.27; NN -16.51,-1.27; P 8.89,1.27; PP -19.05,1.27; R 8.89,-1.27; RR -19.05,-1.27; S 6.35,1.27; SS -21.59,1.27; T 6.35,-1.27; TT -21.59,-1.27; U 3.81,1.27; UU -24.13,1.27; V 3.81,-1.27; W 1.27,1.27; X 1.27,-1.27; Y -1.27,1.27; Z -1.27,-1.27 | drill 0.914: VV -24.13,-1.27
0207/10 = drill 0.813 octagon: 1 -5.08,0; 2 5.08,0
OMNIBUS = hole 3.175: 208.915,209.55; 259.715,209.55; 189.865,209.55; 139.065,209.55; 75.616,209.55; 126.416,209.55; 56.566,209.55; 5.766,209.55

### Placement (x,y rotation side)
AJ2  239.9,22.86 270 top
AK2  236.09,22.86 0 top
AL2  233.55,22.86 90 top
C1  256.41,29.21 90 top
C2  248.79,72.39 180 top
C3  248.79,115.57 180 top
C4  248.79,165.1 180 top
C5  225.93,72.39 180 top
C6  224.66,110.49 180 top
C7  225.93,158.75 180 top
C8  225.93,203.2 180 top
C9  191.64,73.66 180 top
C10  201.8,109.22 180 top
C11  201.8,161.29 180 top
C12  211.96,201.93 180 top
C13  177.67,33.02 180 top
C14  178.94,73.66 180 top
C15  176.4,109.22 0 top
C16  178.94,161.29 180 top
C17  156.08,73.66 180 top
C18  159.89,107.95 180 top
C19  156.08,161.29 180 top
C20  142.11,201.93 180 top
C21  131.95,72.39 180 top
C22  135.76,107.95 180 top
C23  130.68,158.75 180 top
C24  120.52,201.93 180 top
C25  107.82,31.75 180 top
C26  110.36,72.39 180 top
C27  109.09,133.35 180 top
C28  110.36,158.75 180 top
C29  86.23,72.39 180 top
C30  83.69,132.08 180 top
C31  87.5,158.75 180 top
C32  92.58,199.39 180 top
C33  67.18,72.39 180 top
C34  73.53,100.33 270 top
C35  65.91,161.29 180 top
C36  69.72,196.85 180 top
C37  43.05,73.66 180 top
C38  46.86,109.22 0 top
C39  46.86,162.56 180 top
C40  55.75,196.85 180 top
C41  21.46,73.66 180 top
C42  21.46,106.68 180 top
C43  21.46,130.81 180 top
C44  247.52,170.18 0 top
C45  261.49,31.75 90 top
C46  191.64,30.48 90 top
C47  121.79,31.75 90 top
C48  102.74,190.5 90 top
C49  29.08,115.57 90 top
C50  45.59,196.85 270 top
C51  79.88,181.61 90 top
C52  45.59,182.88 270 top
D1  39.24,194.31 270 top
DL1  143.38,143.51 270 top
E1  247.52,50.8 270 top
E2  247.52,93.98 270 top
E3  247.52,144.78 270 top
E4  247.52,184.15 270 top
E5  224.66,50.8 270 top
E6  224.66,95.25 270 top
E7  224.66,146.05 270 top
E8  224.66,184.15 270 top
E9  200.53,50.8 270 top
E10  200.53,92.71 270 top
E11  200.53,146.05 270 top
E12  200.53,184.15 270 top
E13  177.67,50.8 270 top
E14  177.67,93.98 270 top
E15  177.67,146.05 270 top
E16  177.67,184.15 270 top
E17  154.81,50.8 270 top
E18  154.81,92.71 270 top
E19  154.81,146.05 270 top
E20  154.81,184.15 270 top
E21  131.95,50.8 270 top
E22  131.95,93.98 270 top
E23  131.95,146.05 270 top
E24  131.95,184.15 270 top
E25  109.09,50.8 270 top
E26  109.09,93.98 270 top
E27  109.09,146.05 270 top
E28  114.17,184.15 270 top
E29  86.23,50.8 270 top
E30  86.23,93.98 270 top
E31  86.23,146.05 270 top
E32  92.58,184.15 270 top
E33  64.64,50.8 270 top
E34  64.64,93.98 270 top
E35  64.64,146.05 270 top
E36  69.72,184.15 270 top
E37  41.78,50.8 270 top
E38  41.78,92.71 270 top
E39  43.05,146.05 270 top
E40  54.48,184.15 270 top
E41  20.19,50.8 270 top
E42  20.19,93.98 270 top
E43  20.19,119.38 270 top
EDGE  -0.13,0 0 top
J1  27.81,173.99 90 top
R1  83.69,180.34 90 top
R2  36.7,116.84 90 top
R3  162.43,142.24 90 top
R4  167.51,142.24 90 top
R5  190.37,142.24 90 top
R6  237.36,142.24 90 top
R7  258.95,132.08 90 top
R8  39.24,180.34 90 top
R9  41.78,180.34 90 top
R10  106.55,180.34 270 top
R11  34.16,116.84 90 top
R12  41.78,194.31 90 top
R13  30.35,132.08 90 top
U$3  [FLIPCHIP]  -0.13,214.63 270 top
U$4  -0.13,0 0 top

### Tracks (layer width: path | path; a pad name or v marks a point on that pad's centre or on a via)
!BCD1  (1 unrouted)
!C1  (2 unrouted)
!CDONE  (1 unrouted)
!DATA0  (3 unrouted)
!DATA1  (2 unrouted)
!DATA2  (2 unrouted)
!DATA3  (2 unrouted)
!DATA4  (2 unrouted)
!DATA5  (2 unrouted)
!DATA6  (3 unrouted)
!DATA7  (3 unrouted)
!DATA8  (3 unrouted)
!DATA9  (3 unrouted)
!DATA10  (4 unrouted)
!DATA11  (4 unrouted)
!DRDY  (1 unrouted)
!INITIALIZE  (5 unrouted)
!INT_RQST  (3 unrouted)
!INTERNAL_IO  (2 unrouted)
!IO_PAUSE  (1 unrouted)
!IOT63  (1 unrouted)
!IOT67  (1 unrouted)
!MD03  (2 unrouted)
!MD04  (2 unrouted)
!MD05  (1 unrouted)
!MD06  (2 unrouted)
!MD07  (2 unrouted)
!MD08  (2 unrouted)
!MD09  (1 unrouted)
!MD10  (1 unrouted)
!MD11  (1 unrouted)
!PAUSE  (9 unrouted)
!RCNI  (3 unrouted)
!RCNO  (1 unrouted)
!RCRA  (3 unrouted)
!RCRB  (5 unrouted)
!RCRC  (5 unrouted)
!RCRD  (1 unrouted)
!RCSD  (1 unrouted)
!RCSE  (3 unrouted)
!RCSF  (2 unrouted)
!RCSI  (1 unrouted)
!RCTF  (1 unrouted)
!RDY1  (2 unrouted)
!RDY2  (3 unrouted)
!READ  (4 unrouted)
!SKIP  (4 unrouted)
!TCLR  (2 unrouted)
!TP3  (4 unrouted)
!TRANSIT  (3 unrouted)
!ZONE1  (3 unrouted)
!ZONE2  (3 unrouted)
!ZONE3  (3 unrouted)
!ZONE4  (3 unrouted)
!ZONE5  (3 unrouted)
!ZONE6  (4 unrouted)
!ZONE7  (3 unrouted)
!ZONE8  (1 unrouted)
!ZONE9  (2 unrouted)
!ZONE10  (1 unrouted)
!ZONE11  (1 unrouted)
!ZONE12  (2 unrouted)
+3V  (6 unrouted)
AJ2  (1 unrouted)
AK2  (1 unrouted)
AL2  (1 unrouted)
BCD1  (3 unrouted)
BCD2  (3 unrouted)
BCD4  (3 unrouted)
BTP3  (3 unrouted)
BTRANSIT  (1 unrouted)
C_I_R  (1 unrouted)
CDONE  (3 unrouted)
CERR  (1 unrouted)
DATA_STROBE  (5 unrouted)
DCLR  (3 unrouted)
DRDY  (3 unrouted)
GND  (via drill 0.81)  (140 unrouted)
  Top 0.813: EDGE.AT2 213.23,8.26 v213.23,19.05
I00  (1 unrouted)
I01  (1 unrouted)
I02  (1 unrouted)
I03  (1 unrouted)
I04  (1 unrouted)
I05  (1 unrouted)
I06  (1 unrouted)
I07  (1 unrouted)
I08  (1 unrouted)
I09  (1 unrouted)
I10  (1 unrouted)
I11  (1 unrouted)
INITIALIZE  (1 unrouted)
INT  (3 unrouted)
IOT63  (4 unrouted)
IOT67  (4 unrouted)
ITCLK  (3 unrouted)
MD05P  (2 unrouted)
MD06P  (1 unrouted)
MD09P  (2 unrouted)
MD10P  (2 unrouted)
MD11P  (2 unrouted)
N$1  (1 unrouted)
N$2  (2 unrouted)
N$3  (1 unrouted)
N$4  (1 unrouted)
N$5  (2 unrouted)
N$6  (4 unrouted)
N$7  (2 unrouted)
N$8  (1 unrouted)
N$9  (2 unrouted)
N$10  (1 unrouted)
N$11  (1 unrouted)
N$12  (2 unrouted)
N$13  (4 unrouted)
N$14  (1 unrouted)
N$15  (1 unrouted)
N$16  (1 unrouted)
N$18  (2 unrouted)
N$19  (1 unrouted)
N$20  (1 unrouted)
N$21  (1 unrouted)
N$22  (4 unrouted)
N$23  (1 unrouted)
N$24  (1 unrouted)
N$25  (1 unrouted)
N$26  (1 unrouted)
N$27  (1 unrouted)
N$28  (2 unrouted)
N$29  (1 unrouted)
N$30  (1 unrouted)
N$31  (1 unrouted)
N$32  (1 unrouted)
N$33  (1 unrouted)
N$34  (2 unrouted)
N$35  (1 unrouted)
N$36  (24 unrouted)
N$37  (1 unrouted)
N$38  (1 unrouted)
N$39  (1 unrouted)
N$40  (1 unrouted)
N$41  (1 unrouted)
N$42  (1 unrouted)
N$43  (1 unrouted)
N$44  (2 unrouted)
N$45  (1 unrouted)
N$46  (1 unrouted)
N$47  (1 unrouted)
RCNI  (5 unrouted)
RCR  (3 unrouted)
RCRA  (7 unrouted)
RCRB  (13 unrouted)
RCRC  (10 unrouted)
RCSE  (3 unrouted)
RCSI  (1 unrouted)
RDY  (6 unrouted)
READ  (1 unrouted)
READY  (1 unrouted)
STROBE  (7 unrouted)
TP3  (1 unrouted)
TRANSIT  (1 unrouted)
TRBL  (2 unrouted)
VCC  (95 unrouted)
  Top 0.813: C45.+ 264.03,24.13 264.03,52.07 E1.14
  Bottom 0.813: EDGE.AA2 261.49,8.26 C45.+
ZONE1  (1 unrouted)
ZONE2  (1 unrouted)
ZONE3  (1 unrouted)
ZONE4  (1 unrouted)
ZONE5  (1 unrouted)
ZONE6  (1 unrouted)
ZONE7  (1 unrouted)
ZONE8  (2 unrouted)
ZONE9  (2 unrouted)
ZONE10  (2 unrouted)
ZONE11  (2 unrouted)
ZONE12  (2 unrouted)

### Text on the board
Top: CS*ABCDEFHJKLMNPRSTUVWXYZ | + | +
Bottom: 12 BIT WORD 6/E BUS INT. | M1703C | SIDE 2